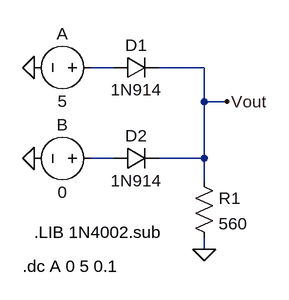
[diagram p0: schematic Pre2.asc]
Pre2.asc, the LTspice schematic file:
Version 4
SHEET 1 880 680
WIRE 256 -16 224 -16
WIRE 384 -16 320 -16
WIRE 384 32 384 -16
WIRE 416 32 384 32
WIRE 256 112 224 112
WIRE 384 112 384 32
WIRE 384 112 320 112
WIRE 384 144 384 112
WIRE 384 240 384 224
FLAG 144 -16 0
FLAG 144 112 0
FLAG 416 32 Vout
FLAG 384 240 0
SYMBOL voltage 240 -16 R90
WINDOW 0 -32 56 VBottom 2
WINDOW 3 32 56 VTop 2
WINDOW 123 0 0 Left 0
WINDOW 39 0 0 Left 0
SYMATTR InstName A
SYMATTR Value 5
SYMBOL voltage 240 112 R90
WINDOW 0 -32 56 VBottom 2
WINDOW 3 32 56 VTop 2
WINDOW 123 0 0 Left 0
WINDOW 39 0 0 Left 0
SYMATTR InstName B
SYMATTR Value 0
SYMBOL diode 256 0 R270
WINDOW 0 32 32 VTop 2
WINDOW 3 0 32 VBottom 2
SYMATTR InstName D1
SYMATTR Value 1N914
SYMBOL diode 256 128 R270
WINDOW 0 32 32 VTop 2
WINDOW 3 0 32 VBottom 2
SYMATTR InstName D2
SYMATTR Value 1N914
SYMBOL res 368 128 R0
SYMATTR InstName R1
SYMATTR Value 560
TEXT 144 216 Left 2 !.LIB 1N4002.sub
TEXT 128 264 Left 2 !.dc A 0 5 0.1

The netlist it stands for:
* Pre2.asc
V§A N001 0 5
V§B N002 0 0
D1 N001 Vout 1N914
D2 N002 Vout 1N914
R1 Vout 0 560
.model D D
.lib standard.dio
.LIB 1N4002.sub
.dc A 0 5 0.1
.backanno
.end